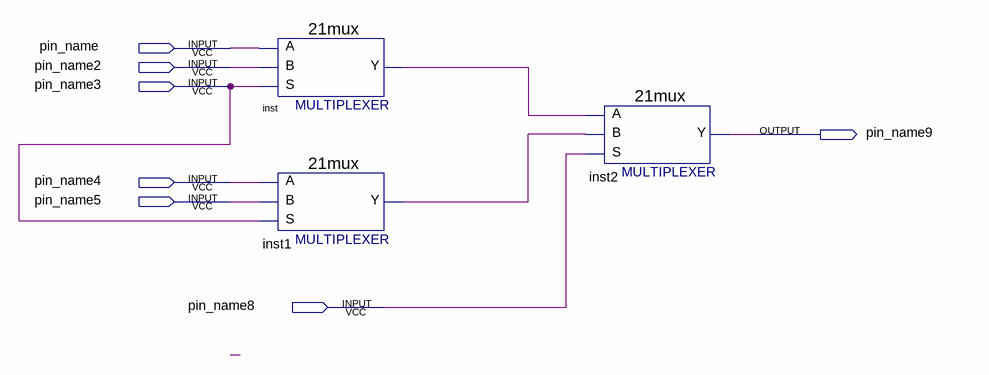
[diagram p0: schematic sheet]
// Quartus schematic fco_draw.bdf as structural Verilog: 3 symbols, 7 pins
module fco_draw (
  input  pin_name,
  input  pin_name2,
  input  pin_name3,
  input  pin_name4,
  input  pin_name5,
  input  pin_name8,
  output pin_name9
);

  wire inst1_y, inst_y;

  \21mux  inst (.S(pin_name3), .B(pin_name2), .A(pin_name), .Y(inst_y));
  \21mux  inst1 (.S(pin_name3), .B(pin_name5), .A(pin_name4), .Y(inst1_y));
  \21mux  inst2 (.S(pin_name8), .B(inst1_y), .A(inst_y), .Y(pin_name9));
endmodule
